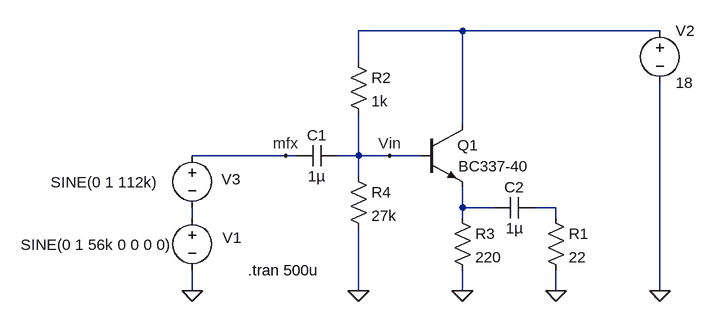
[diagram p0: schematic mfx-linear.asc]
mfx-linear.asc, the LTspice schematic file:
Version 4
SHEET 1 880 680
WIRE 64 -16 -96 -16
WIRE 368 -16 64 -16
WIRE -96 32 -96 -16
WIRE 64 128 64 -16
WIRE -208 176 -352 176
WIRE -192 176 -208 176
WIRE -96 176 -96 112
WIRE -96 176 -128 176
WIRE -48 176 -96 176
WIRE 0 176 -48 176
WIRE -96 208 -96 176
WIRE 64 256 64 224
WIRE 112 256 64 256
WIRE 208 256 176 256
WIRE -352 272 -352 256
WIRE 64 272 64 256
WIRE 208 272 208 256
WIRE -352 384 -352 352
WIRE -96 384 -96 288
WIRE 64 384 64 352
WIRE 208 384 208 352
WIRE 368 384 368 64
FLAG 64 384 0
FLAG -96 384 0
FLAG -208 176 mfx
FLAG -48 176 Vin
FLAG 368 384 0
FLAG 208 384 0
FLAG -352 384 0
SYMBOL npn 0 128 R0
WINDOW 3 58 64 Left 2
SYMATTR InstName Q1
SYMATTR Value BC337-40
SYMBOL res -112 16 R0
SYMATTR InstName R2
SYMATTR Value 1k
SYMBOL cap -128 160 R90
WINDOW 0 0 32 VBottom 2
WINDOW 3 32 32 VTop 2
SYMATTR InstName C1
SYMATTR Value 1µ
SYMBOL voltage -352 256 R0
WINDOW 0 47 46 Left 2
WINDOW 3 -264 57 Left 2
WINDOW 123 0 0 Left 2
WINDOW 39 0 0 Left 2
SYMATTR InstName V1
SYMATTR Value SINE(0 1 56k 0 0 0 0)
SYMBOL voltage 368 -32 R0
WINDOW 123 0 0 Left 2
WINDOW 39 0 0 Left 2
SYMATTR InstName V2
SYMATTR Value 18
SYMBOL res -112 192 R0
SYMATTR InstName R4
SYMATTR Value 27k
SYMBOL res 48 256 R0
SYMATTR InstName R3
SYMATTR Value 220
SYMBOL cap 176 240 R90
WINDOW 0 0 32 VBottom 2
WINDOW 3 32 32 VTop 2
SYMATTR InstName C2
SYMATTR Value 1µ
SYMBOL res 192 256 R0
SYMATTR InstName R1
SYMATTR Value 22
SYMBOL voltage -352 160 R0
WINDOW 0 45 52 Left 2
WINDOW 3 -218 57 Left 2
WINDOW 123 0 0 Left 2
WINDOW 39 0 0 Left 2
SYMATTR InstName V3
SYMATTR Value SINE(0 1 112k)
TEXT -266 352 Left 2 !.tran 500u

The netlist it stands for:
* mfx-linear.asc
Q1 N001 Vin N002 0 BC337-40
R2 N001 Vin 1k
C1 Vin mfx 1µ
V1 N004 0 SINE(0 1 56k 0 0 0 0)
V2 N001 0 18
R4 Vin 0 27k
R3 N002 0 220
C2 N003 N002 1µ
R1 N003 0 22
V3 mfx N004 SINE(0 1 112k)
.model NPN NPN
.model PNP PNP
.lib standard.bjt
.tran 500u
.backanno
.end